# Altium project Laser MCU.PrjPcb (part 3 of 4)

## Sheet USB_AND_POWER.SchDoc
size 431 x 279 mm; Organization: ORGANIZATION; Address1: 207; Address2: 13399 104 Ave; Address3: Surrey BC, V3T 0C9; Address4: Canada; Revision: V0.0.0; SheetNumber: 2; SheetTotal: 5; ENG_APP_DATE: --/--/--; DSN_APP_DATE: --/--/--; CHK_APP_DATE: --/--/--
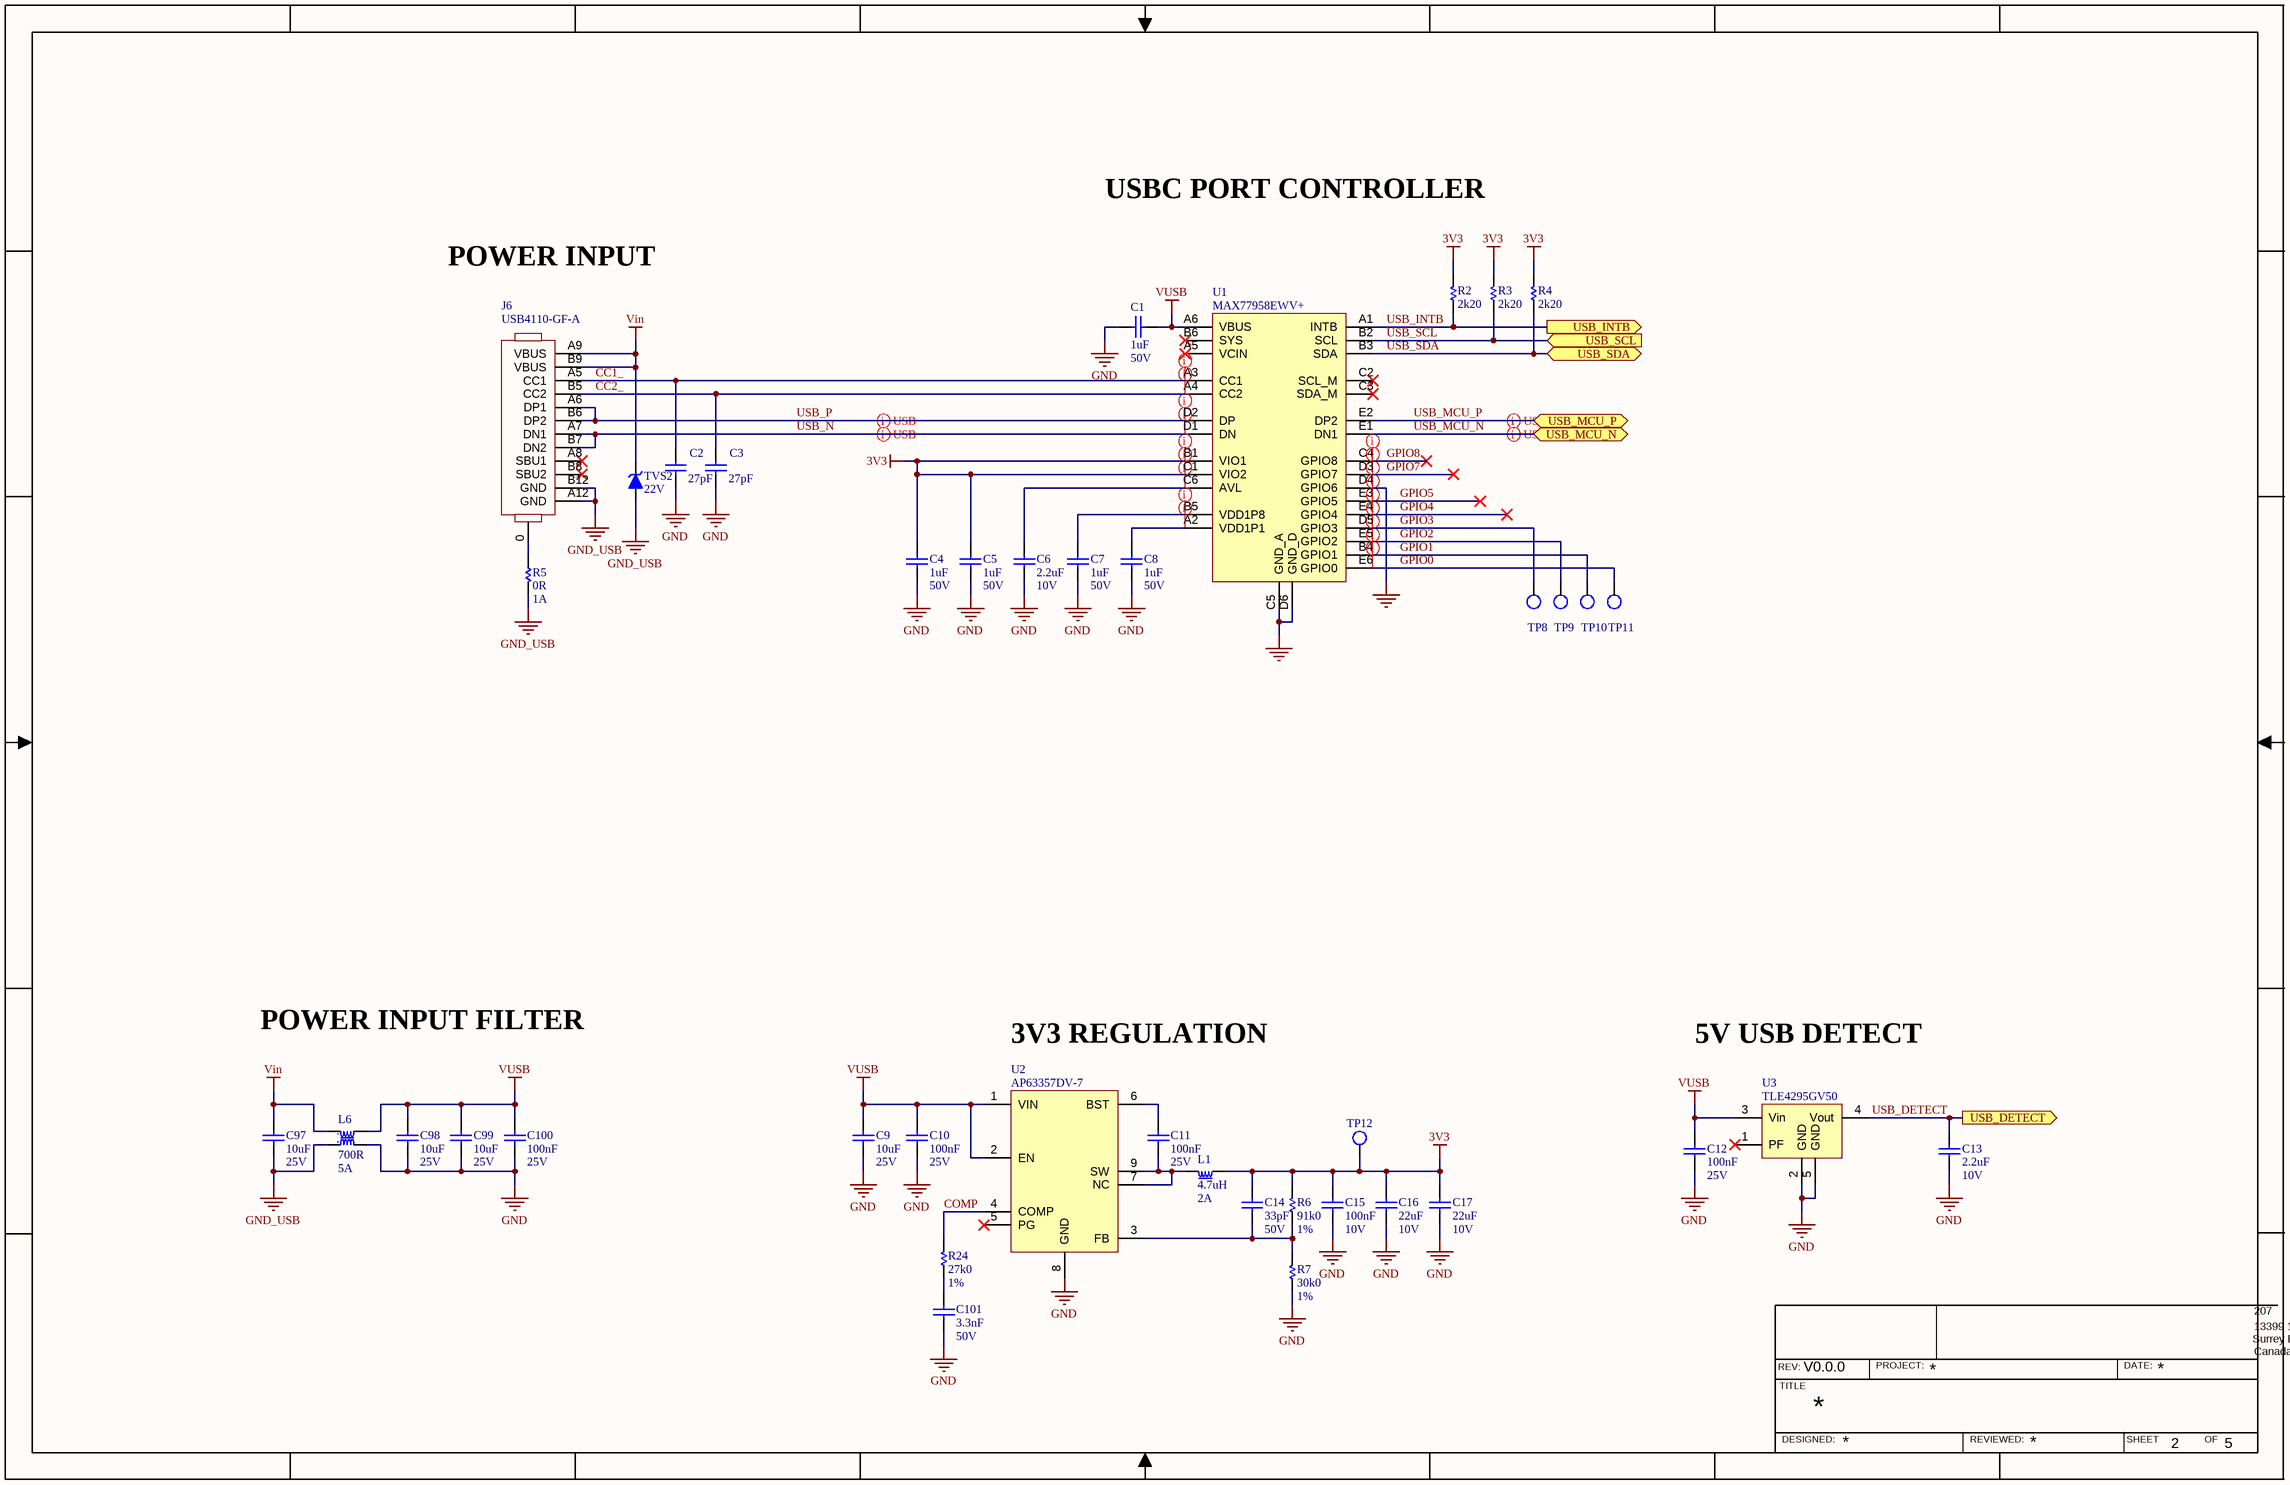
[diagram p3: USB_AND_POWER.SchDoc]

### Parts
C1  1uF  Voltage Rating: 50V  [c0603]
C2  27pF  [C0402]
C3  27pF  [C0402]
C4  1uF  Voltage Rating: 50V  [c0603]
C5  1uF  Voltage Rating: 50V  [c0603]
C6  2.2uF  Voltage Rating: 10V  [C0402]
C7  1uF  Voltage Rating: 50V  [c0603]
C8  1uF  Voltage Rating: 50V  [c0603]
C9  10uF  Voltage Rating: 25V  [c0805]
C10  100nF  Voltage Rating: 25V  [C0402]
C11  100nF  Voltage Rating: 25V  [C0402]
C12  100nF  Voltage Rating: 25V  [C0402]
C13  2.2uF  Voltage Rating: 10V  [C0402]
C14  33pF  Voltage Rating (DC): 50V  [C0402]
C15  100nF  Voltage Rating: 10V  [C0201]
C16  22uF  Voltage Rating: 10V  [c0603]
C17  22uF  Voltage Rating: 10V  [c0603]
C97  10uF  Voltage Rating: 25V  [c0805]
C98  10uF  Voltage Rating: 25V  [c0805]
C99  10uF  Voltage Rating: 25V  [c0805]
C100  100nF  Voltage Rating: 25V  [C0402]
C101  3.3nF  Voltage Rating: 50V  [C0402]
J6  USB4110-GF-A  [CONN USBC 12PIN RA SMD]
L1  4.7uH  Saturation Current: 2A  [IND 4.9x4.9x3.1mm]
L6  700R  Max DC Current: 5A  [IND CM 9070]
R2  2k20  [R0402]
R3  2k20  [R0402]
R4  2k20  [R0402]
R5  0R  Current Rating: 1A  [R0603]
R6  91k0  Tolerance: 1%  [r0402]
R7  30k0  Tolerance: 1%  [r0402]
R24  27k0  Tolerance: 1%  [R0402]
TP8  1mm  [TESTPOINT_SMT]  (value not drawn)  (no BOM)
TP9  1mm  [TESTPOINT_SMT]  (value not drawn)  (no BOM)
TP10  1mm  [TESTPOINT_SMT]  (value not drawn)  (no BOM)
TP11  1mm  [TESTPOINT_SMT]  (value not drawn)  (no BOM)
TP12  1mm  [TESTPOINT_SMT]  (value not drawn)  (no BOM)
TVS2  22V  [DIODE SMA]
U1  MAX77958EWV+  [BGA30C50P6X5 MAX77958EWV+]
U2  AP63357DV-7  [VDFN3020-13 AP63357DV-7]
U3  TLE4295GV50  [PG-SCT595-5]

### Ports
USB_DETECT (out), USB_INTB (out), USB_MCU_N (bidir), USB_MCU_P (bidir), USB_SCL (in), USB_SDA (bidir)

### Nets
3V3: C4.1 C5.1 C14.2 C15.1 C16.2 C17.2 L1.2 R2.2 R3.2 R4.2 R6.2 TP12.1 U1.B1(VIO1) U1.C1(VIO2)
GND: C1.2 C2.1 C3.1 C4.2 C5.2 C6.1 C7.2 C8.2 C9.1 C10.2 C12.2 C13.1 C15.2 C16.1 C17.1 C98.1 C99.1 C100.2 C101.1 L6.3 R7.1 U1.C5(GND_A) U1.D4(GPIO6) U1.D6(GND_D) U2.8(GND) U3.2(GND) U3.5(GND)
GND_USB: C97.1 J6.A12(GND) J6.B12(GND) L6.4 R5.2 TVS2.2(A)
Vin: C97.2 J6.A9(VBUS) J6.B9(VBUS) L6.1 TVS2.1(K)
VUSB: C1.1 C9.2 C10.1 C12.1 C98.2 C99.2 C100.1 L6.2 U1.A6(VBUS) U2.1(VIN) U2.2(EN) U3.3(Vin)
CC1_: C2.2 J6.A5(CC1) U1.A3(CC1)
CC2_: C3.2 J6.B5(CC2) U1.A4(CC2)
COMP: R24.2 U2.4(COMP)
GPIO0: TP11.1 U1.E6(GPIO0)
GPIO1: TP10.1 U1.B4(GPIO1)
GPIO2: TP9.1 U1.E5(GPIO2)
GPIO3: TP8.1 U1.D5(GPIO3)
GPIO4: U1.E4(GPIO4)
GPIO5: U1.E3(GPIO5)
GPIO7: U1.D3(GPIO7)
GPIO8: U1.C4(GPIO8)
USB_DETECT: C13.2 U3.4(Vout) ; port USB_DETECT
USB_INTB: R2.1 U1.A1(INTB) ; port USB_INTB
USB_MCU_N: U1.E1(DN1) ; port USB_MCU_N
USB_MCU_P: U1.E2(DP2) ; port USB_MCU_P
USB_N: J6.A7(DN1) J6.B7(DN2) U1.D1(DN)
USB_P: J6.A6(DP1) J6.B6(DP2) U1.D2(DP)
USB_SCL: R3.1 U1.B2(SCL) ; port USB_SCL
USB_SDA: R4.1 U1.B3(SDA) ; port USB_SDA
NetC6_2: C6.2 U1.C6(AVL)
NetC7_1: C7.1 U1.B5(VDD1P8)
NetC8_1: C8.1 U1.A2(VDD1P1)
NetC11_1: C11.1 U2.6(BST)
NetC11_2: C11.2 L1.1 U2.7(NC) U2.9(SW)
NetC14_1: C14.1 R6.1 R7.2 U2.3(FB)
NetC101_2: C101.2 R24.1
NetJ6_0: J6.0 R5.1

Not connected (* = marked no-connect by the designer): J6 A8(SBU1)* B8(SBU2)*; U1 A5(VCIN)* B6(SYS)* C2(SCL_M)* C3(SDA_M)*; U2 5(PG)*; U3 1(PF)*

### Layout directives
differential pair; net class USB; rule Impedance Constraint [Min = 42.50    Max = 57.50    ]; rule Matched Net Lengths [Tolerance = 1.1mm]; differential pair class USB_DIFF: USB_N, USB_P
net class BGA_FINE_PITCH: 3V3, CC1_, CC2_, GND, GPIO0, GPIO1, GPIO2, GPIO3, GPIO4, GPIO5, GPIO7, GPIO8, NetC6_2, NetC7_1, NetC8_1, USB_N, USB_P
differential pair; net class USB; rule Impedance Constraint [Min = 42.50    Max = 57.50    ]; rule Matched Net Lengths [Tolerance = 1.1mm]; differential pair class USB_DIFF_USB: USB_MCU_N, USB_MCU_P

### Notes on the sheet
- USBC PORT CONTROLLER
- POWER INPUT
- POWER INPUT FILTER
- 3V3 REGULATION
- 5V USB DETECT
- REV:
- PROJECT:
- DATE:
- TITLE
- SHEET
- OF
- DESIGNED:
- REVIEWED:

### Library data of the parts
C1 C4 C5 C7 C8 = CAP CER 1uF 50V X5R 0603: Multilayer Ceramic Capacitors (High dielectric type), 50V, 1 uF, ± 10 %, 0603, X5R, RoHS; Manufacturer: Taiyo Yuden; Manufacturer Part Number: UMK107BJ105KA-T; Tolerance: 10%; Supplier 1: Digi-Key; RoHS: Yes; Category: Ceramic Capacitors; Stock 1: 955108; Pricing 1: 1=0.19000, 10=0.12900, 50=0.07760, 100=0.06560, 500=0.04484, 1000=0.03968 (USD); Mount: Surface Mount; Case/Package: 0603; Number of Pins: 2; Case Code (Metric): 1608; Case Code (Imperial): 0603; Contact Plating: Nickel; Min Operating Temperature: -55°C; Max Operating Temperature: 85°C; Capacitance: 1uF; Packaging: Tape and Reel; Package Quantity: 1; Dielectric: X5R; Voltage Rating (DC): 50V; Termination: SMD/SMT; Series: M; Construction: Flat; Length: 1.6mm; Width: 0.031inch; Height: 0.8mm; Depth: 0.8mm; Thickness: 0.035inch; Radiation Hardening: No; RoHS Compliant: Yes; REACH SVHC: Unknown; Halogen Free: Halogen Free; ComponentLink1URL: https://datasheet.ciiva.com/134/umk107bj105ka-t-ss-134740.pdf?src-supplier=Digi-Key; ComponentLink1Description: https://datasheet.ciiva.com/134/umk107bj105ka-t-ss-134740.pdf?src-supplier=Digi-Key; ComponentLink2URL: https://datasheet.ciiva.com/11601/umk107bj105ka-t-ss-11601811.pdf?src-supplier=Avnet; ComponentLink2Description: https://datasheet.ciiva.com/11601/umk107bj105ka-t-ss-11601811.pdf?src-supplier=Avnet; ComponentLink3URL: https://datasheet.ciiva.com/5744/1697715-5744913.pdf?src-supplier=Farnell; ComponentLink3Description: https://datasheet.ciiva.com/5744/1697715-5744913.pdf?src-supplier=Farnell; ComponentLink4URL: https://datasheet.ciiva.com/30199/43umk107bj105ka-t-30199791.pdf?src-supplier=Onlinecomponents.com; ComponentLink4Description: https://datasheet.ciiva.com/30199/43umk107bj105ka-t-30199791.pdf?src-supplier=Onlinecomponents.com; ComponentLink5URL: https://datasheet.ciiva.com/15922/336umk107bj105ka-t-15922611.pdf?src-supplier=Onlinecomponents.com; ComponentLink5Description: https://datasheet.ciiva.com/15922/336umk107bj105ka-t-15922611.pdf?src-supplier=Onlinecomponents.com; ComponentLink6URL: https://datasheet.ciiva.com/5427/mlcc-all-e-541559-5427036.pdf?src-supplier=Mouser; ComponentLink6Description: https://datasheet.ciiva.com/5427/mlcc-all-e-541559-5427036.pdf?src-supplier=Mouser; ComponentLink7URL: https://datasheet.ciiva.com/7975/mlcc-all-e-7975898.pdf?src-supplier=Element14; ComponentLink7Description: https://datasheet.ciiva.com/7975/mlcc-all-e-7975898.pdf?src-supplier=Element14; ComponentLink8URL: https://datasheet.ciiva.com/7975/1697715-7975608.pdf?src-supplier=Element14; ComponentLink8Description: https://datasheet.ciiva.com/7975/1697715-7975608.pdf?src-supplier=Element14; ComponentLink9URL: https://datasheet.ciiva.com/22694/1697715-22694278.pdf?src-supplier=Element14; ComponentLink9Description: https://datasheet.ciiva.com/22694/1697715-22694278.pdf?src-supplier=Element14; Supplier Part Number 1: 587-2400-1-ND
C2 C3 = CAP CER 27pF 50V C0G 0402: 贴片陶瓷电容  27pF ±5% 50V C0G(NP0) 0402; Manufacturer: Samsung; Manufacturer Part Number: CL05C270JB5NNNC; Material: Ceramic; Temperature Coefficient: 300ppm/°C; Supplier 1: RSComponents; RoHS: Yes; Category: Ceramic Capacitors; Stock 1: 1; Pricing 1: 10000=0.00700, 30000=0.00700, 50000=0.00500, 100000=0.00500, 250000=0.00400 (USD); Mount: Surface Mount; Case/Package: 0402; Case Code (Metric): 1005; Case Code (Imperial): 0402; Contact Plating: Tin; Min Operating Temperature: -55°C; Max Operating Temperature: 125°C; Capacitance: 27pF; Tolerance: 5%; Packaging: Tape and Reel; Package Quantity: 1; Voltage Rating: 50V; Dielectric: C0G; Voltage: 50V; Series: CL; Voltage Rating (DC): 50V; Length: 1mm; Width: 0.02inch; Height: 0.5mm; Thickness: 0.022inch; Depth: 0.5mm; Radiation Hardening: No; RoHS Compliant: Yes; Lead Free: Lead Free; ComponentLink1URL: https://datasheet.ciiva.com/25806/cl05c270jb5nnnc-25806401.pdf?src-supplier=Digi-Key; ComponentLink1Description: https://datasheet.ciiva.com/25806/cl05c270jb5nnnc-25806401.pdf?src-supplier=Digi-Key; ComponentLink2URL: https://datasheet.ciiva.com/26838/getdatasheetpartid-359687-26838295.pdf?src-supplier=Verical; ComponentLink2Description: https://datasheet.ciiva.com/26838/getdatasheetpartid-359687-26838295.pdf?src-supplier=Verical; ComponentLink3URL: https://datasheet.ciiva.com/29198/458634-da-01-en-vs-kondensator-0402-29198410.pdf?src-supplier=Conrad; ComponentLink3Description: https://datasheet.ciiva.com/29198/458634-da-01-en-vs-kondensator-0402-29198410.pdf?src-supplier=Conrad; ComponentLink4URL: https://datasheet.ciiva.com/16391/cl05b104kq5nnnc-16391291.pdf?src-supplier=Future+Electronics; ComponentLink4Description: https://datasheet.ciiva.com/16391/cl05b104kq5nnnc-16391291.pdf?src-supplier=Future+Electronics; Supplier Part Number 1: 7661429
C6 C13 = CAP CER 2.2uF 10V X5R 0402: -; Manufacturer: Taiyo Yuden; Manufacturer Part Number: LMK105BJ225MV-F; Tolerance: 20%; Dielectric: X5R; Supplier 1: Newark; RoHS: Yes; Category: Ceramic Capacitors; Stock 1: 2002; Pricing 1: 1=0.10000, 25=0.03300, 100=0.02300, 250=0.02000, 500=0.01700, 1000=0.01500 (USD); Mount: Surface Mount; Case/Package: 0402; Case Code (Imperial): 0402; Case Code (Metric): 1005; Min Operating Temperature: -55°C; Max Operating Temperature: 85°C; Packaging: Tape and Reel; Capacitance: 2.2uF; Package Quantity: 1; Voltage Rating (DC): 10V; Termination: SMD/SMT; Series: M; Construction: Flat; Resistor Type: Ceramic; Length: 1mm; Width: 0.5mm; Height: 0.5mm; Thickness: 0.022inch; Depth: 0.5mm; Radiation Hardening: No; RoHS Compliant: Yes; REACH SVHC: Unknown; Halogen Free: Halogen Free; ComponentLink1URL: https://datasheet.ciiva.com/134/lmk105bj225mv-f-ss-134677.pdf?src-supplier=Digi-Key; ComponentLink1Description: https://datasheet.ciiva.com/134/lmk105bj225mv-f-ss-134677.pdf?src-supplier=Digi-Key; ComponentLink2URL: https://datasheet.ciiva.com/23631/lmk105bj225mv-f-ss-23631491.pdf?src-supplier=Newark; ComponentLink2Description: https://datasheet.ciiva.com/23631/lmk105bj225mv-f-ss-23631491.pdf?src-supplier=Newark; ComponentLink3URL: https://datasheet.ciiva.com/15921/286lmk105bj225mv-f-15921222.pdf?src-supplier=Onlinecomponents.com; ComponentLink3Description: https://datasheet.ciiva.com/15921/286lmk105bj225mv-f-15921222.pdf?src-supplier=Onlinecomponents.com; ComponentLink4URL: https://datasheet.ciiva.com/30190/500lmk105bj225mv-f-30190498.pdf?src-supplier=Onlinecomponents.com; ComponentLink4Description: https://datasheet.ciiva.com/30190/500lmk105bj225mv-f-30190498.pdf?src-supplier=Onlinecomponents.com; Supplier Part Number 1: 78T6311
C9 C97-C99 = CAP CER 10uF 25V X5R 0805: Cap Ceramic 10uF 25V X5R 10% SMD 0805 85°C Embossed T/R; Manufacturer: Samsung; Manufacturer Part Number: CL21A106KAYNNNE; Supplier 1: Digi-Key; RoHS: Yes; Category: Ceramic Capacitors; Stock 1: 2266338; Pricing 1: 2000=0.03549, 4000=0.03247 (USD); Mount: Surface Mount; Case/Package: 0805; Case Code (Metric): 2012; Case Code (Imperial): 0805; Min Operating Temperature: -55°C; Max Operating Temperature: 85°C; Package Quantity: 1; Packaging: Tape and Reel; Capacitance: 10uF; Tolerance: 10%; Dielectric: X5R; Series: CL; Construction: Flat; Length: 2mm; Width: 0.049inch; Height: 1.25mm; Depth: 1.25mm; Thickness: 0.057inch; Radiation Hardening: No; RoHS Compliant: Yes; ComponentLink1URL: https://datasheet.ciiva.com/25796/cl21a106kaynnne-25796720.pdf?src-supplier=Digi-Key; ComponentLink1Description: https://datasheet.ciiva.com/25796/cl21a106kaynnne-25796720.pdf?src-supplier=Digi-Key; ComponentLink2URL: https://datasheet.ciiva.com/26838/getdatasheetpartid-357558-26838583.pdf?src-supplier=Verical; ComponentLink2Description: https://datasheet.ciiva.com/26838/getdatasheetpartid-357558-26838583.pdf?src-supplier=Verical; Supplier Part Number 1: 1276-2891-2-ND
C10-C12 C100 = CAP CER 100nF 25V X5R 0402: Cap Ceramic 0.1uF 25V X5R 10% Pad SMD 0402 85¡ãC T/R / Multi Layer Ceramic Capacitor (MLCC); Manufacturer: Samsung; Manufacturer Part Number: CL05A104KA5NNNC; Supplier 1: Digi-Key; RoHS: Yes; Category: Ceramic Capacitors; Stock 1: 8053194; Pricing 1: 1=0.10000, 10=0.01100, 50=0.00600, 100=0.00490, 500=0.00346, 1000=0.00272, 2500=0.00248, 5000=0.00228 (USD); Mount: Surface Mount; Case/Package: 0402; Case Code (Metric): 1005; Case Code (Imperial): 0402; Min Operating Temperature: -55°C; Max Operating Temperature: 85°C; Capacitance: 100nF; Tolerance: 10%; Dielectric: X5R; Packaging: Tape and Reel; Package Quantity: 1; Voltage: 25V; Series: CL; Construction: Flat; Voltage Rating (DC): 25V; Length: 1mm; Width: 0.02inch; Height: 0.5mm; Thickness: 0.022inch; Depth: 0.5mm; Radiation Hardening: No; Lead Free: Lead Free; ComponentLink1URL: https://datasheet.ciiva.com/25802/cl05a104ka5nnnc-25802704.pdf?src-supplier=Digi-Key; ComponentLink1Description: https://datasheet.ciiva.com/25802/cl05a104ka5nnnc-25802704.pdf?src-supplier=Digi-Key; ComponentLink2URL: https://datasheet.ciiva.com/26838/getdatasheetpartid-357412-26838142.pdf?src-supplier=Verical; ComponentLink2Description: https://datasheet.ciiva.com/26838/getdatasheetpartid-357412-26838142.pdf?src-supplier=Verical; ComponentLink3URL: https://datasheet.ciiva.com/16437/cl05a104ka5nnnc-16437369.pdf?src-supplier=Future+Electronics; ComponentLink3Description: https://datasheet.ciiva.com/16437/cl05a104ka5nnnc-16437369.pdf?src-supplier=Future+Electronics; ComponentLink4URL: https://datasheet.ciiva.com/26309/mlcc-catalogdownload2013-eng-26309014.pdf?src-supplier=Distrelec; ComponentLink4Description: https://datasheet.ciiva.com/26309/mlcc-catalogdownload2013-eng-26309014.pdf?src-supplier=Distrelec; Supplier Part Number 1: 1276-1043-1-ND
C14 = CAP CER 33pF 50V C0G 0402: 0402 33 pF 50 V ±5 % Tolerance NP0 SMT Multilayer Ceramic Capacitor; Manufacturer: Yageo; Manufacturer Part Number: CC0402JRNPO9BN330; Tolerance: 5%; Dielectric: C0G; Insulation Resistance: 100GR; Supplier 1: Future Electronics; RoHS: Yes; Category: Ceramic Capacitors; Stock 1: 23000000; Pricing 1: 10000=0.00240, 40000=0.00230, 150000=0.00220, 400000=0.00210, 1000000=0.00200 (USD); Mount: Surface Mount; Case/Package: 0402; Number of Pins: 2; Case Code (Imperial): 0402; Case Code (Metric): 1005; Weight: 2.3E-05oz; Dielectric Material: Ceramic; Min Operating Temperature: -55°C; Max Operating Temperature: 125°C; Capacitance: 33pF; Series: CC; Voltage Rating: 50V; Packaging: Tape and Reel; Package Quantity: 1; Termination: SMD/SMT; Resistor Type: Ceramic; Length: 1mm; Width: 0.02inch; Height: 0.5mm; Depth: 0.5mm; Thickness: 0.022inch; Radiation Hardening: No; RoHS Compliant: Yes; Reach SVHC Compliant: Yes; Lead Free: Lead Free; ComponentLink1URL: https://datasheet.ciiva.com/143/mlccorderingcode-143996.pdf?src-supplier=Digi-Key; ComponentLink1Description: https://datasheet.ciiva.com/143/mlccorderingcode-143996.pdf?src-supplier=Digi-Key; ComponentLink2URL: https://datasheet.ciiva.com/143/mlccorderingcode-143995.pdf?src-supplier=Digi-Key; ComponentLink2Description: https://datasheet.ciiva.com/143/mlccorderingcode-143995.pdf?src-supplier=Digi-Key; ComponentLink3URL: https://datasheet.ciiva.com/143/mlccorderingcode-143997.pdf?src-supplier=Digi-Key; ComponentLink3Description: https://datasheet.ciiva.com/143/mlccorderingcode-143997.pdf?src-supplier=Digi-Key; ComponentLink4URL: https://datasheet.ciiva.com/26862/getdatasheetpartid-403453-26862599.pdf?src-supplier=Verical; ComponentLink4Description: https://datasheet.ciiva.com/26862/getdatasheetpartid-403453-26862599.pdf?src-supplier=Verical; ComponentLink5URL: https://datasheet.ciiva.com/28450/1443161-28450254.pdf?src-supplier=Element14; ComponentLink5Description: https://datasheet.ciiva.com/28450/1443161-28450254.pdf?src-supplier=Element14; ComponentLink6URL: https://datasheet.ciiva.com/8033/1443161-8033611.pdf?src-supplier=Element14; ComponentLink6Description: https://datasheet.ciiva.com/8033/1443161-8033611.pdf?src-supplier=Element14; ComponentLink7URL: https://datasheet.ciiva.com/8033/1443161-8033610.pdf?src-supplier=Element14; ComponentLink7Description: https://datasheet.ciiva.com/8033/1443161-8033610.pdf?src-supplier=Element14; ComponentLink8URL: https://datasheet.ciiva.com/13263/upy-gp-np0-16v-to-50v-8-3714-13263802.pdf?src-supplier=Mouser; ComponentLink8Description: https://datasheet.ciiva.com/13263/upy-gp-np0-16v-to-50v-8-3714-13263802.pdf?src-supplier=Mouser; Supplier Part Number 1: 7066913
C15 = CAP CER 100nF 10V X5R 0201: CAP CER 0.1UF 10V X5R 0201; Manufacturer 1: Murata; Manufacturer Part Number 1: GRM033R61A104ME15D; Tolerance: 20%; Category 1: Ceramic Capacitors; Supplier 1: Newark; Stock 1: 345000; Pricing 1: 1=0.00300, 15000=0.00300 (USD); Case/Package: 0201; Case Code (Metric): 0603; Case Code (Imperial): 0201; Min Operating Temperature: -55°C; Max Operating Temperature: 85°C; Dielectric: X5R; Packaging: Tape and Reel; Package Quantity: 10; Series: GRM; Voltage Rating (DC): 10V; Length: 0.024inch; Width: 0.012inch; Thickness: 0.013inch; Depth: 0.3mm; Lead Free: Lead Free; ComponentLink1URL: https://datasheet.ciiva.com/131/partnumbering-e-01-131478.pdf?src-supplier=Digi-Key; ComponentLink1Description: https://datasheet.ciiva.com/131/partnumbering-e-01-131478.pdf?src-supplier=Digi-Key; ComponentLink2URL: https://datasheet.ciiva.com/131/partnumbering-e-01-131479.pdf?src-supplier=Digi-Key; ComponentLink2Description: https://datasheet.ciiva.com/131/partnumbering-e-01-131479.pdf?src-supplier=Digi-Key; Supplier Part Number 1: 65AH6960; RoHS 1: Yes; Description 1: CAP CER 0.1UF 10V X5R 0201; Mounting Technology: Surface Mount; Value: 100nF; RoHS Compliant: Yes
C16 C17 = CAP CER 22uF 10V X5R 0603: 0603 22 uF 10 V ±20% Tolerance X5R Multilayer Ceramic Chip Capacitor; Manufacturer: Murata; Manufacturer Part Number: GRM188R61A226ME15D; Supplier 1: Newark; RoHS: Yes; Category: Ceramic Capacitors; Stock 1: 3156000; Pricing 1: 1=0.04900, 4000=0.04700, 8000=0.04400, 16000=0.04300, 24000=0.04200 (USD); Mount: Surface Mount; Case/Package: 0603; Case Code (Metric): 1608; Case Code (Imperial): 0603; Material: Ceramic; Weight: 0.000222oz; Min Operating Temperature: -55°C; Max Operating Temperature: 85°C; Capacitance: 22uF; Tolerance: 20%; Packaging: Cut Tape; Dielectric: X5R; Termination: SMD/SMT; Voltage Rating (DC): 10V; Package Quantity: 4000; Series: GRM; Length: 1.6mm; Width: 0.8mm; Height: 0.8mm; Thickness: 0.039inch; Depth: 0.8mm; Reach SVHC Compliant: Yes; Lead Free: Lead Free; RoHS Compliant: Yes; ComponentLink1URL: https://datasheet.ciiva.com/46444/1769893-46444975.pdf?src-supplier=Element14; ComponentLink1Description: https://datasheet.ciiva.com/46444/1769893-46444975.pdf?src-supplier=Element14; Supplier Part Number 1: 03AC2659
C101 = CAP CER 3.3nF 50V X7R 0402: CAP CER 3300PF 50V X7R 0402; Manufacturer 1: Samsung; Manufacturer Part Number 1: CL05B332KB5NNNC; Category 1: Ceramic Capacitors; Material: Ceramic; Tolerance: 10%; Supplier 1: Newark; Supplier Part Number 1: 82AC9229; RoHS 1: Yes; Description 1: CAP CER 3300PF 50V X7R 0402; Stock 1: 47056; Pricing 1: 1=0.10000, 25=0.01400, 100=0.00600, 250=0.00500, 500=0.00400, 1000=0.00300 (USD); Mounting Technology: Surface Mount; Case/Package: 0402; Case Code (Metric): 1005; Case Code (Imperial): 0402; Contact Plating: Tin; Min Operating Temperature: -55°C; Max Operating Temperature: 125°C; Value: 3.3nF; Package Quantity: 1; Packaging: Tape and Reel; Dielectric: X7R; Voltage: 50V; Series: CL; Construction: Flat; Voltage Rating (DC): 50V; Length: 1mm; Width: 0.02inch; Height: 0.5mm; Thickness: 0.022inch; Depth: 0.5mm; Radiation Hardening: No; RoHS Compliant: Yes; Lead Free: Lead Free; ComponentLink1URL: https://datasheet.ciiva.com/16396/cl05b332kb5nnnc-16396965.pdf?src-supplier=Future+Electronics; ComponentLink1Description: https://datasheet.ciiva.com/16396/cl05b332kb5nnnc-16396965.pdf?src-supplier=Future+Electronics; ComponentLink2URL: https://datasheet.ciiva.com/15195/getdatasheetpartid-358613-15195646.pdf?src-supplier=Verical; ComponentLink2Description: https://datasheet.ciiva.com/15195/getdatasheetpartid-358613-15195646.pdf?src-supplier=Verical; ComponentLink3URL: https://datasheet.ciiva.com/29198/458961-da-01-en-vs-kondensator-0402-29198316.pdf?src-supplier=Conrad; ComponentLink3Description: https://datasheet.ciiva.com/29198/458961-da-01-en-vs-kondensator-0402-29198316.pdf?src-supplier=Conrad
J6 = CONN USBC 12PIN RA SMD USB4110-GF-A: Conn USB Type C RCP 16 POS 0.3mm/0.5mm Solder ST SMD 16 Terminal 1 Port T/R; Manufacturer: Global Connector Technology; Supplier 1: Newark; Manufacturer Part Number: USB4110-GF-A; RoHS: No; Category: USB Connectors; Stock 1: 4800; Pricing 1: 1=1.34000, 10=1.18000, 25=1.11000, 50=1.07000, 100=1.02000, 250=0.92400, 500=0.83200, 1200=0.83200 (USD); ComponentLink1URL: https://gct.co/files/drawings/usb4110.pdf?src-supplier=Digi-Key; ComponentLink1Description: https://gct.co/files/drawings/usb4110.pdf?src-supplier=Digi-Key; Supplier Part Number 1: 71AJ9394
L1 = IND 4.7uH 2A 72mR 5020: Inductor Power Shielded Wirewound 4.7uH 20% 100KHz Ferrite 2A 0.072Ohm DCR T/R; Manufacturer: Taiyo Yuden; Manufacturer Part Number: NRS5020T4R7MMGJ; Self Resonant Frequency: 37MHz; DC Resistance (DCR): 72mR; Supplier 1: Future Electronics; RoHS: Yes; Category: Fixed Inductors; Stock 1: 30400; Pricing 1: 800=0.10400, 2400=0.09960, 4000=0.09770, 12000=0.09360, 20000=0.09000 (USD); Mount: Surface Mount; Case/Package: 5020; Number of Pins: 2; Core Material: Ferrite; Min Operating Temperature: -25°C; Max Operating Temperature: 125°C; Package Quantity: 1; Current Rating: 2A; Tolerance: 20%; Shielding: Shielded; Packaging: Tape and Reel; Inductance: 4.7uH; Test Frequency: 100kHz; Max DC Current: 2A; Termination: SMD/SMT; Resistor Type: Wirewound; Series: NRS; Inductance Tolerance: 20%; RMS Current (Irms): 2A; Length: 4.9mm; Width: 0.193inch; Height: 2mm; Height - Seated (Max): 0.079inch; Depth: 5.1mm; Lead Pitch: 3.3mm; Radiation Hardening: No; Halogen Free: Halogen Free; RoHS Compliant: Yes; Lead Free: Lead Free; ComponentLink1URL: https://datasheet.ciiva.com/1043/nrs5020t4r7mmgj-ss-1043731.pdf?src-supplier=Digi-Key; ComponentLink1Description: https://datasheet.ciiva.com/1043/nrs5020t4r7mmgj-ss-1043731.pdf?src-supplier=Digi-Key; ComponentLink2URL: https://datasheet.ciiva.com/22624/1697192-22624163.pdf?src-supplier=Element14; ComponentLink2Description: https://datasheet.ciiva.com/22624/1697192-22624163.pdf?src-supplier=Element14; ComponentLink3URL: https://datasheet.ciiva.com/25607/0900766b810b3cd2-25607197.pdf?src-supplier=Rs; ComponentLink3Description: https://datasheet.ciiva.com/25607/0900766b810b3cd2-25607197.pdf?src-supplier=Rs; Supplier Part Number 1: 5053658
L6 = IND CM 700R 3A ACM9070-701-2PL-TL01: ACM Series 3628 700 Ohm 5 A 10 mOhm DCR 80 V SMT Common Mode Filter; Manufacturer 1: TDK; Category 1: Common Mode Chokes; Voltage Rating (DC): 80V; Number of Lines: 2; DC Resistance (DCR): 10mR; Test Frequency: 100MHz; Element Configuration: Dual; Shielding: Unshielded; Supplier 1: Newark; Supplier Part Number 1: 30Y9775; Manufacturer Part Number 1: ACM9070-701-2PL-TL01; RoHS 1: Yes; Description 1: ACM Series 3628 700 Ohm 5 A 10 mOhm DCR 80 V SMT Common Mode Filter; Stock 1: 4956; Pricing 1: 1=1.87000, 10=1.43000, 25=1.35000, 50=1.27000, 100=1.19000 (USD); Mounting Technology: Surface Mount; Case/Package: 3628; Pins: 4; Min Operating Temperature: -40°C; Max Operating Temperature: 85°C; Package Quantity: 800; Impedance: 700R; Packaging: Tape and Reel; Current Rating: 5A; Termination: SMD/SMT; Series: ACM; Max Current Rating: 5A; Current: 5A; DC Current: 5A; Insulation Resistance: 10MR; Length: 9mm; Width: 7mm; Height: 4.5mm; Depth: 7.2mm; Radiation Hardening: No; Lead Free: Lead Free; Reach SVHC Compliant: Yes; RoHS Compliant: Yes; ComponentLink1URL: https://datasheet.ciiva.com/22726/1866262-22726286.pdf?src-supplier=Element14; ComponentLink1Description: https://datasheet.ciiva.com/22726/1866262-22726286.pdf?src-supplier=Element14; ComponentLink2URL: https://datasheet.ciiva.com/22726/1866262-22726287.pdf?src-supplier=Element14; ComponentLink2Description: https://datasheet.ciiva.com/22726/1866262-22726287.pdf?src-supplier=Element14; ComponentLink3URL: https://datasheet.ciiva.com/6216/e9713-acm-6216583.pdf?src-supplier=Digi-Key; ComponentLink3Description: https://datasheet.ciiva.com/6216/e9713-acm-6216583.pdf?src-supplier=Digi-Key; ComponentLink4URL: https://datasheet.ciiva.com/6216/e9713-acm-6216582.pdf?src-supplier=Digi-Key; ComponentLink4Description: https://datasheet.ciiva.com/6216/e9713-acm-6216582.pdf?src-supplier=Digi-Key; ComponentLink5URL: https://datasheet.ciiva.com/6216/e9713-acm-6216584.pdf?src-supplier=Digi-Key; ComponentLink5Description: https://datasheet.ciiva.com/6216/e9713-acm-6216584.pdf?src-supplier=Digi-Key; ComponentLink6URL: https://datasheet.ciiva.com/3068/e9713-acm-3068617.pdf?src-supplier=Avnet; ComponentLink6Description: https://datasheet.ciiva.com/3068/e9713-acm-3068617.pdf?src-supplier=Avnet; ComponentLink7URL: https://datasheet.ciiva.com/30098/e9713-acm-30098950.pdf?src-supplier=Onlinecomponents.com; ComponentLink7Description: https://datasheet.ciiva.com/30098/e9713-acm-30098950.pdf?src-supplier=Onlinecomponents.com
R2-R4 = RES 2k20 1% 63mW 0402: 贴片电阻 2200Ω ± 1.00% 0.0625W ± 100ppm/℃ 0402; Manufacturer: Yageo; Manufacturer Part Number: RC0402FR-072K2L; Resistance: 2.2kR; Tolerance: 1%; Power Rating: 63mW; Voltage Rating: 50V; Temperature Coefficient: 100ppm/°C; Supplier 1: RSComponents; RoHS: Yes; Category: Chip SMD Resistors; Stock 1: 10500; Pricing 1: 10000=0.00300 (GBP); Case/Package: 0402; Case Code (Imperial): 0402; Case Code (Metric): 1005; Weight: 2.3E-05oz; Size Code: 0402; Min Operating Temperature: -55°C; Max Operating Temperature: 155°C; Resistor Type: Thick Film; Packaging: Tape and Reel; Termination: SMD/SMT; Features: Moisture Resistant; Series: RC; Max Power Dissipation: 63mW; Number of Terminations: 2; Resistance Tolerance: 1%; Construction: Rectangular; Technology: THICK FILM; Length: 1mm; Width: 0.5mm; Height: 0.35mm; Depth: 0.5mm; RoHS Compliant: Yes; REACH SVHC: Unknown; Military Standard: Not; Lead Free: Lead Free; ComponentLink1URL: https://datasheet.ciiva.com/11808/0900766b80c66297-11808786.pdf?src-supplier=RSComponents; ComponentLink1Description: https://datasheet.ciiva.com/11808/0900766b80c66297-11808786.pdf?src-supplier=RSComponents; ComponentLink2URL: https://datasheet.ciiva.com/7983/1018594-7983515.pdf?src-supplier=Element14; ComponentLink2Description: https://datasheet.ciiva.com/7983/1018594-7983515.pdf?src-supplier=Element14; ComponentLink3URL: https://datasheet.ciiva.com/46383/1018594-46383563.pdf?src-supplier=Element14; ComponentLink3Description: https://datasheet.ciiva.com/46383/1018594-46383563.pdf?src-supplier=Element14; ComponentLink4URL: https://datasheet.ciiva.com/12577/pyu-rc0402-51-rohs-l-6-r-12577429.pdf?src-supplier=Mouser; ComponentLink4Description: https://datasheet.ciiva.com/12577/pyu-rc0402-51-rohs-l-6-r-12577429.pdf?src-supplier=Mouser; ComponentLink5URL: https://datasheet.ciiva.com/7849/1018594-7849929.pdf?src-supplier=Element14; ComponentLink5Description: https://datasheet.ciiva.com/7849/1018594-7849929.pdf?src-supplier=Element14; ComponentLink6URL: https://datasheet.ciiva.com/7849/1018594-7849928.pdf?src-supplier=Element14; ComponentLink6Description: https://datasheet.ciiva.com/7849/1018594-7849928.pdf?src-supplier=Element14; ComponentLink7URL: https://datasheet.ciiva.com/16741/pyu-rc0402-51-rohs-l-6-r-16741015.pdf?src-supplier=Future+Electronics; ComponentLink7Description: https://datasheet.ciiva.com/16741/pyu-rc0402-51-rohs-l-6-r-16741015.pdf?src-supplier=Future+Electronics; Supplier Part Number 1: 1987730
R5 = RES 0R 100mW 0603: Res Thkflm 0603 0 Ohm Jumper 1/10W 100Ppm/ C Smd Rohs Compliant: Yes; Manufacturer: Stackpole Electronics; Manufacturer Part Number: RMCF0603ZT0R00; Power Rating: 100mW; Working Voltage: 75V; Supplier 1: Avnet; RoHS: Yes; Category: Chip SMD Resistors; Stock 1: 18060000; Pricing 1: 5000=0.00142, 10000=0.00140, 20000=0.00136, 30000=0.00133, 40000=0.00128, 50000=0.00125, 500000=0.00122 (USD); Mount: Surface Mount; Case/Package: 0603; Case Code (Metric): 1608; Case Code (Imperial): 0603; Contact Plating: Tin,Matte; Min Operating Temperature: -55°C; Max Operating Temperature: 155°C; Resistance: 0R; Packaging: Tape and Reel; Resistor Type: Thick Film; Number of Terminations: 2; Max Power Dissipation: 100mW; Features: Automotive AEC-Q200; Series: RMCF; Construction: Rectangular; Length: 1.55mm; Width: 0.031inch; Height: 0.022inch; Depth: 0.8mm; Radiation Hardening: No; Lead Free: Lead Free; Military Standard: Not; RoHS Compliant: Yes; ComponentLink1URL: https://www.seielect.com/catalog/SEI-Packaging.pdf?src-supplier=Avnet; ComponentLink1Description: https://www.seielect.com/catalog/SEI-Packaging.pdf?src-supplier=Avnet; ComponentLink2URL: https://www.seielect.com/catalog/SEI-Packaging.pdf?src-supplier=Arrow+Electronics; ComponentLink2Description: https://www.seielect.com/catalog/SEI-Packaging.pdf?src-supplier=Arrow+Electronics; ComponentLink3URL: https://www.seielect.com/catalog/SEI-Packaging.pdf?src-supplier=Verical; ComponentLink3Description: https://www.seielect.com/catalog/SEI-Packaging.pdf?src-supplier=Verical; ComponentLink4URL: https://www.seielect.com/Catalog/SEI-RMCF_RMCP.pdf?src-supplier=Digi-Key; ComponentLink4Description: https://www.seielect.com/Catalog/SEI-RMCF_RMCP.pdf?src-supplier=Digi-Key; ComponentLink5URL: https://www.seielect.com/catalog/SEI-Packaging.pdf?src-supplier=Digi-Key; ComponentLink5Description: https://www.seielect.com/catalog/SEI-Packaging.pdf?src-supplier=Digi-Key; Supplier Part Number 1: RMCF0603ZT0R00
R6 = RES 91k0 1% 63mW 0402: Res Thick Film 0402 91K Ohm 1% 0.063W(1/16W) }100ppm/? Molded SMD Paper T/R; Manufacturer: Yageo; Manufacturer Part Number: RC0402FR-0791KL; Power Rating: 63mW; Temperature Coefficient: 100ppm/°C; Resistance: 91kR; Voltage Rating: 50V; Supplier 1: Future Electronics; RoHS: Yes; Category: Chip SMD Resistors; Stock 1: 370000; Pricing 1: 10000=0.00100, 100000=0.00090, 300000=0.00090, 1250000=0.00090, 3000000=0.00080 (USD); Case/Package: 0402; Case Code (Metric): 1005; Case Code (Imperial): 0402; Size Code: 0402; Min Operating Temperature: -55°C; Max Operating Temperature: 155°C; Series: RC; Package Quantity: 1; Packaging: Tape and Reel; Resistor Type: Thick Film; Number of Terminations: 2; Termination: SMD/SMT; Max Power Dissipation: 63mW; Voltage Rating (DC): 50V; Features: Moisture Resistant; Construction: Rectangular; Resistance Tolerance: 1%; Length: 1mm; Width: 0.02inch; Height: 0.016inch; Depth: 0.5mm; RoHS Compliant: Yes; Military Standard: Not; Lead Free: Lead Free; ComponentLink1URL: https://datasheet.ciiva.com/7850/1018594-7850120.pdf?src-supplier=Element14; ComponentLink1Description: https://datasheet.ciiva.com/7850/1018594-7850120.pdf?src-supplier=Element14; ComponentLink2URL: https://datasheet.ciiva.com/7850/1018594-7850119.pdf?src-supplier=Element14; ComponentLink2Description: https://datasheet.ciiva.com/7850/1018594-7850119.pdf?src-supplier=Element14; ComponentLink3URL: https://datasheet.ciiva.com/2453/pyu-r-int-thick-7-2453575.pdf?src-supplier=Digi-Key; ComponentLink3Description: https://datasheet.ciiva.com/2453/pyu-r-int-thick-7-2453575.pdf?src-supplier=Digi-Key; ComponentLink4URL: https://datasheet.ciiva.com/2453/pyu-r-int-thick-7-2453576.pdf?src-supplier=Digi-Key; ComponentLink4Description: https://datasheet.ciiva.com/2453/pyu-r-int-thick-7-2453576.pdf?src-supplier=Digi-Key; ComponentLink5URL: https://datasheet.ciiva.com/2453/pyu-r-int-thick-7-2453574.pdf?src-supplier=Digi-Key; ComponentLink5Description: https://datasheet.ciiva.com/2453/pyu-r-int-thick-7-2453574.pdf?src-supplier=Digi-Key; Supplier Part Number 1: 4968699
R7 = RES 30k0 1% 63mW 0402: Res General Purpose Thick Film 0402 30k Ohm 1% 1/16W ±100ppm/°C Molded Paper T/R; Manufacturer: Yageo; Manufacturer Part Number: RC0402FR-0730KL; Resistance: 30kR; Power Rating: 62.5mW; Voltage Rating: 50V; Max Power Dissipation: 63mW; Supplier 1: Digi-Key; RoHS: Yes; Category: Chip SMD Resistors; Stock 1: 1354843; Pricing 1: 10000=0.00186 (USD); Case/Package: 0402; Case Code (Imperial): 0402; Case Code (Metric): 1005; Weight: 2.3E-05oz; Size Code: 0402; Min Operating Temperature: -55°C; Max Operating Temperature: 155°C; Packaging: Tape and Reel; Termination: SMD/SMT; Resistor Type: Thick Film; Temperature Coefficient: 100ppm/°C; Voltage Rating (DC): 50V; Features: Moisture Resistant; Series: RC; Number of Terminations: 2; Resistance Tolerance: 1%; Construction: Rectangular; Length: 1mm; Width: 0.5mm; Height: 0.35mm; Depth: 0.5mm; RoHS Compliant: Yes; REACH SVHC: Unknown; Military Standard: Not; Lead Free: Lead Free; ComponentLink1URL: https://datasheet.ciiva.com/12577/pyu-rc0402-51-rohs-l-6-r-12577743.pdf?src-supplier=Mouser; ComponentLink1Description: https://datasheet.ciiva.com/12577/pyu-rc0402-51-rohs-l-6-r-12577743.pdf?src-supplier=Mouser; ComponentLink2URL: https://datasheet.ciiva.com/7849/1018594-7849957.pdf?src-supplier=Element14; ComponentLink2Description: https://datasheet.ciiva.com/7849/1018594-7849957.pdf?src-supplier=Element14; ComponentLink3URL: https://datasheet.ciiva.com/46394/1018594-46394938.pdf?src-supplier=Element14; ComponentLink3Description: https://datasheet.ciiva.com/46394/1018594-46394938.pdf?src-supplier=Element14; Supplier Part Number 1: 311-30.0KLRTR-ND
R24 = RES 27k0 1% 63mW 0402: Res Thick Film 0402 27K Ohm 1% 0.063W(1/16W) ±100ppm/C Pad SMD T/R; Manufacturer 1: Yageo; Manufacturer Part Number 1: RC0402FR-0727KL; Category 1: Chip SMD Resistors; Value: 27kR; Power Rating: 63mW; Voltage Rating: 50V; Temperature Coefficient: 100ppm/°C; Supplier 1: Future Electronics; Supplier Part Number 1: 5799804; RoHS 1: Yes; Description 1: Res Thick Film 0402 27K Ohm 1% 0.063W(1/16W) ±100ppm/C Pad SMD T/R; Stock 1: 3360000; Pricing 1: 10000=0.00100, 50000=0.00100, 300000=0.00090, 1000000=0.00090, 3000000=0.00080 (USD); Case/Package: 0402; Case Code (Imperial): 0402; Case Code (Metric): 1005; Min Operating Temperature: -55°C; Max Operating Temperature: 155°C; Packaging: Tape and Reel; Package Quantity: 10000; Termination: SMD/SMT; Resistor Type: Thick Film; Number of Terminations: 2; Max Power Dissipation: 63mW; Features: Moisture Resistant; Series: RC; Resistance Tolerance: 1%; Technology: THICK FILM; Construction: Rectangular; Length: 0.039inch; Width: 0.02inch; Height: 0.016inch; Depth: 0.5mm; RoHS Compliant: Yes; Military Standard: Not; Lead Free: Lead Free; ComponentLink1URL: https://datasheet.ciiva.com/11819/0900766b80c66297-11819497.pdf?src-supplier=Rs; ComponentLink1Description: https://datasheet.ciiva.com/11819/0900766b80c66297-11819497.pdf?src-supplier=Rs; ComponentLink2URL: https://datasheet.ciiva.com/2453/pyu-r-int-thick-7-2453562.pdf?src-supplier=Digi-Key; ComponentLink2Description: https://datasheet.ciiva.com/2453/pyu-r-int-thick-7-2453562.pdf?src-supplier=Digi-Key; ComponentLink3URL: https://datasheet.ciiva.com/7849/1018594-7849925.pdf?src-supplier=Element14; ComponentLink3Description: https://datasheet.ciiva.com/7849/1018594-7849925.pdf?src-supplier=Element14; ComponentLink4URL: https://datasheet.ciiva.com/16772/pyu-rc0402-51-rohs-l-6-r-16772092.pdf?src-supplier=Future+Electronics; ComponentLink4Description: https://datasheet.ciiva.com/16772/pyu-rc0402-51-rohs-l-6-r-16772092.pdf?src-supplier=Future+Electronics
TP8-TP12 = TP 1mm: SMT testpoint
TVS2 = DIODE TVS 22V SMA: Zen Tvs 400W 22V Uni Do-214Ac Tr13 / Tr Rohs Compliant: Yes; Manufacturer: Littelfuse; Manufacturer Part Number: SZ1SMA22AT3G; Supplier 1: Digi-Key; RoHS: Yes; Category: TVS Diodes; Stock 1: 8478; Pricing 1: 1=0.61000, 10=0.52400, 100=0.39130, 500=0.30744, 1000=0.23758, 2000=0.21661 (USD); RoHS Compliant: Yes; Supplier Part Number 1: F11511CT-ND
U1 = IC USBC POWER CONTROLLER STANDALONE MAX77958EWV+: Industry's Simplest Standalone USB Type-C and USB Power Delivery Controller; Manufacturer: Maxim; Supplier 1: Mouser; Manufacturer Part Number: MAX77958EWV+; RoHS: Yes; Stock 1: 1588; Pricing 1: 1=2.71000, 10=2.43000, 20=2.30000, 50=2.30000, 100=1.95000, 200=1.84000, 500=1.60000, 1000=1.37000, 2000=1.33000, 10000=1.33000 (USD); Supplier Part Number 1: 700-MAX77958EWV+
U2 = IC REG BUCK 32V 3.5A AP63357DV-7: AP63357 Series 32 V 3.5 A 450 kHz Synchronous Buck Converter - DFN3020-13; Manufacturer: Diodes; Supplier 1: Digi-Key; Manufacturer Part Number: AP63357DV-7; RoHS: Yes; Category: Voltage Regulators - Switching; Stock 1: 1191; Pricing 1: 1=0.98000, 10=0.88000, 25=0.83560, 100=0.68630, 250=0.64152, 500=0.56694, 1000=0.44758 (USD); Supplier Part Number 1: 31-AP63357DV-7CT-ND
U3 = IC REG LIN 5V 30mA TLE4295GV50: LDO Regulator Pos 5V 0.03A Automotive 5-Pin(3+2Tab) SCT-595; Manufacturer: Infineon; Number of Outputs: 1; Output Current: 30mA; Dropout Voltage: 250mV; Max Input Voltage: 45V; Min Input Voltage: 3.5V; Quiescent Current: 120uA; Accuracy: 4%; Polarity: Positive; Output Type: Fixed; Supplier 1: Newark; Manufacturer Part Number: TLE4295GV50; RoHS: Yes; Category: Uncategorized; Stock 1: 3000; Pricing 1: 1=1.67000, 10=1.49000, 25=1.42000, 50=1.30000, 100=1.17000, 250=1.09000, 500=0.96300, 1000=0.77100 (USD); Case/Package: SMD/SMT; Number of Pins: 5; Min Operating Temperature: -40°C; Max Operating Temperature: 150°C; Packaging: Tape and Reel; Max Output Current: 30mA; Output Voltage: 5V; Package Quantity: 1; Number of Regulators: 1; Min Current Limit: 30mA; Length: 2.9mm; Width: 1.6mm; Height: 1.1mm; Radiation Hardening: No; RoHS Compliant: Yes; ComponentLink1URL: https://datasheet.ciiva.com/41439/001183754-da-01-en-ic-reg-ldo-5v-tle4295g-v50-sct-595-5-inf-41439532.pdf?src-supplier=Conrad; ComponentLink1Description: https://datasheet.ciiva.com/41439/001183754-da-01-en-ic-reg-ldo-5v-tle4295g-v50-sct-595-5-inf-41439532.pdf?src-supplier=Conrad; Supplier Part Number 1: 50Y7890